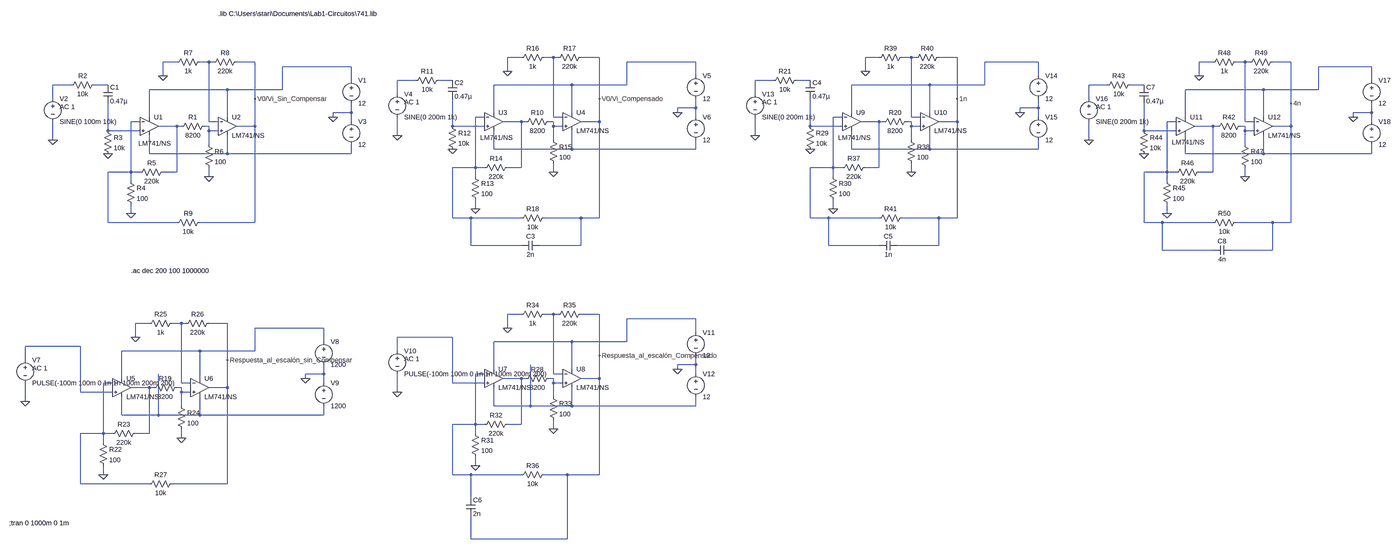
[diagram p0: schematic Draft1.asc, whole sheet]
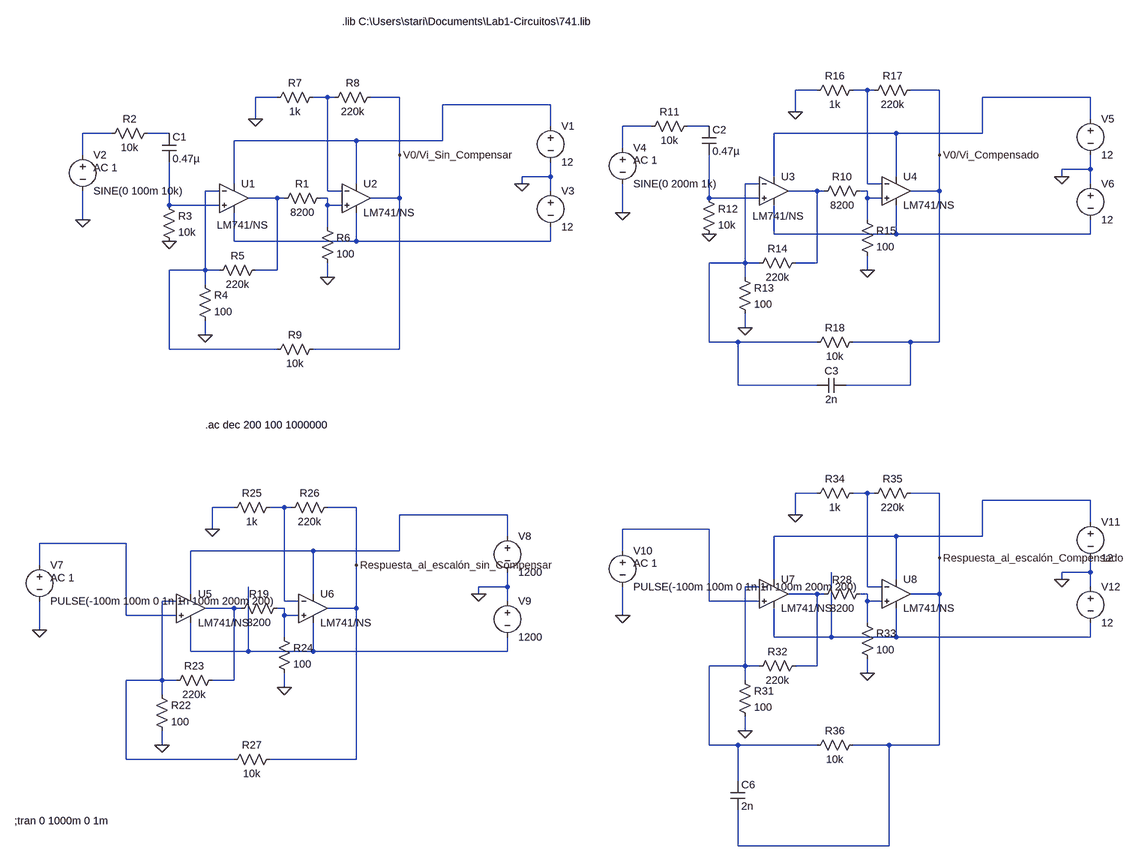
[diagram p1: schematic Draft1.asc, part, row 1 of 1, column 1 of 2]
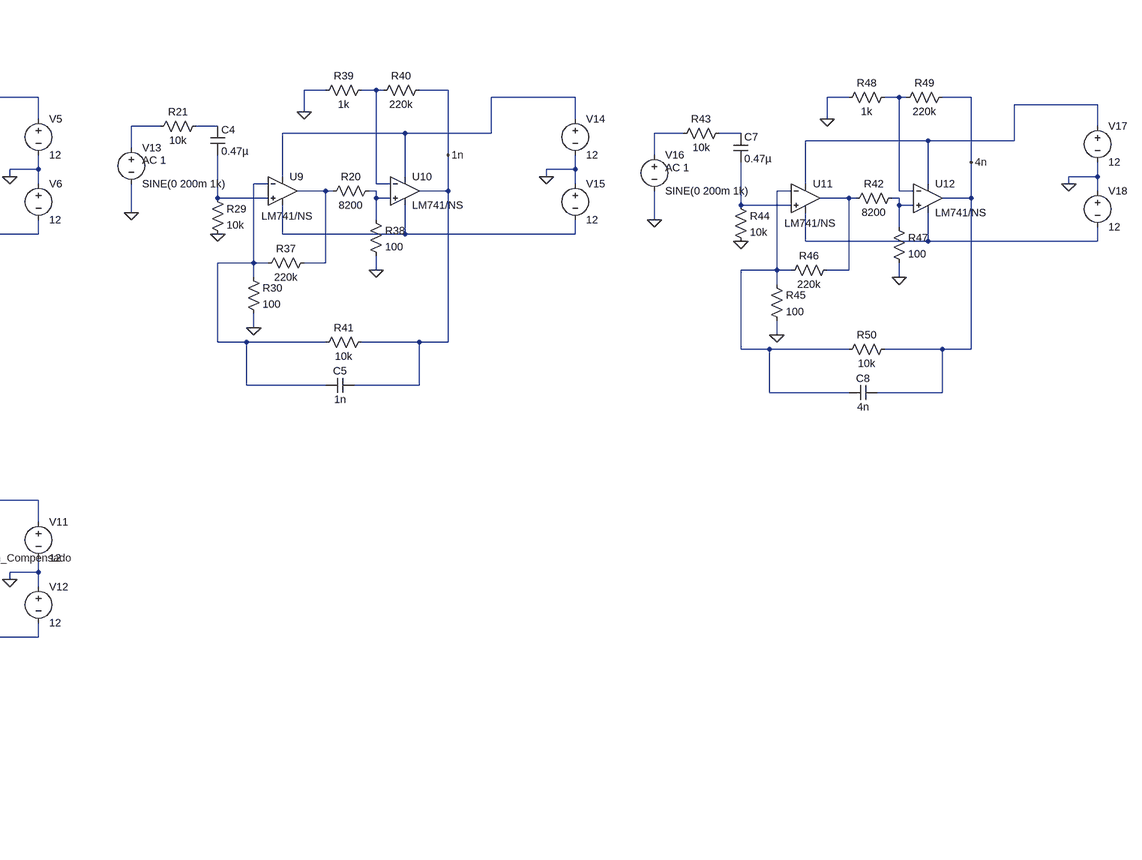
[diagram p2: schematic Draft1.asc, part, row 1 of 1, column 2 of 2]
Draft1.asc, the LTspice schematic file:
Version 4.1
SHEET 1 3112 680
WIRE -1312 -1520 -1360 -1520
WIRE -1200 -1520 -1232 -1520
WIRE -1184 -1520 -1200 -1520
WIRE -1040 -1520 -1104 -1520
WIRE -64 -1520 -112 -1520
WIRE 48 -1520 16 -1520
WIRE 64 -1520 48 -1520
WIRE 208 -1520 144 -1520
WIRE -2512 -1504 -2560 -1504
WIRE -2400 -1504 -2432 -1504
WIRE -2384 -1504 -2400 -1504
WIRE -2240 -1504 -2304 -1504
WIRE -704 -1504 -944 -1504
WIRE 544 -1504 304 -1504
WIRE 1152 -1504 1104 -1504
WIRE 1264 -1504 1232 -1504
WIRE 1280 -1504 1264 -1504
WIRE 1424 -1504 1360 -1504
WIRE -1904 -1488 -2144 -1488
WIRE 1760 -1488 1520 -1488
WIRE -1360 -1472 -1360 -1520
WIRE -112 -1472 -112 -1520
WIRE -2560 -1456 -2560 -1504
WIRE -704 -1456 -704 -1504
WIRE 544 -1456 544 -1504
WIRE 1104 -1456 1104 -1504
WIRE -1904 -1440 -1904 -1488
WIRE -1680 -1440 -1744 -1440
WIRE -1552 -1440 -1600 -1440
WIRE -432 -1440 -496 -1440
WIRE -304 -1440 -352 -1440
WIRE 1760 -1440 1760 -1488
WIRE -2880 -1424 -2944 -1424
WIRE -2752 -1424 -2800 -1424
WIRE -1136 -1424 -1408 -1424
WIRE -944 -1424 -944 -1504
WIRE -944 -1424 -1136 -1424
WIRE 112 -1424 -160 -1424
WIRE 304 -1424 304 -1504
WIRE 304 -1424 112 -1424
WIRE 784 -1424 720 -1424
WIRE 912 -1424 864 -1424
WIRE -2336 -1408 -2608 -1408
WIRE -2144 -1408 -2144 -1488
WIRE -2144 -1408 -2336 -1408
WIRE 1328 -1408 1056 -1408
WIRE 1520 -1408 1520 -1488
WIRE 1520 -1408 1328 -1408
WIRE -1744 -1392 -1744 -1440
WIRE -496 -1392 -496 -1440
WIRE -2944 -1376 -2944 -1424
WIRE -2240 -1376 -2240 -1504
WIRE -1040 -1376 -1040 -1520
WIRE 208 -1376 208 -1520
WIRE 720 -1376 720 -1424
WIRE 1424 -1360 1424 -1504
WIRE -704 -1344 -704 -1376
WIRE -704 -1344 -768 -1344
WIRE 544 -1344 544 -1376
WIRE 544 -1344 480 -1344
WIRE -1904 -1328 -1904 -1360
WIRE -1904 -1328 -1968 -1328
WIRE -1408 -1328 -1408 -1424
WIRE -1136 -1328 -1136 -1424
WIRE -768 -1328 -768 -1344
WIRE -160 -1328 -160 -1424
WIRE 112 -1328 112 -1424
WIRE 480 -1328 480 -1344
WIRE 1760 -1328 1760 -1360
WIRE 1760 -1328 1696 -1328
WIRE -2608 -1312 -2608 -1408
WIRE -2336 -1312 -2336 -1408
WIRE -1968 -1312 -1968 -1328
WIRE -1440 -1312 -1472 -1312
WIRE -1200 -1312 -1200 -1520
WIRE -1168 -1312 -1200 -1312
WIRE -704 -1312 -704 -1344
WIRE -192 -1312 -224 -1312
WIRE 48 -1312 48 -1520
WIRE 80 -1312 48 -1312
WIRE 544 -1312 544 -1344
WIRE 1056 -1312 1056 -1408
WIRE 1328 -1312 1328 -1408
WIRE 1696 -1312 1696 -1328
WIRE -2640 -1296 -2672 -1296
WIRE -2400 -1296 -2400 -1504
WIRE -2368 -1296 -2400 -1296
WIRE -1904 -1296 -1904 -1328
WIRE -1312 -1296 -1376 -1296
WIRE -1296 -1296 -1312 -1296
WIRE -1200 -1296 -1216 -1296
WIRE -1040 -1296 -1040 -1376
WIRE -1040 -1296 -1104 -1296
WIRE -64 -1296 -128 -1296
WIRE -48 -1296 -64 -1296
WIRE 48 -1296 32 -1296
WIRE 208 -1296 208 -1376
WIRE 208 -1296 144 -1296
WIRE 1024 -1296 992 -1296
WIRE 1264 -1296 1264 -1504
WIRE 1296 -1296 1264 -1296
WIRE 1760 -1296 1760 -1328
WIRE -2512 -1280 -2576 -1280
WIRE -2496 -1280 -2512 -1280
WIRE -2400 -1280 -2416 -1280
WIRE -2240 -1280 -2240 -1376
WIRE -2240 -1280 -2304 -1280
WIRE -1552 -1280 -1552 -1376
WIRE -1440 -1280 -1552 -1280
WIRE -1200 -1280 -1200 -1296
WIRE -1168 -1280 -1200 -1280
WIRE -304 -1280 -304 -1376
WIRE -192 -1280 -304 -1280
WIRE 48 -1280 48 -1296
WIRE 80 -1280 48 -1280
WIRE 1152 -1280 1088 -1280
WIRE 1168 -1280 1152 -1280
WIRE 1264 -1280 1248 -1280
WIRE 1424 -1280 1424 -1360
WIRE 1424 -1280 1360 -1280
WIRE -2752 -1264 -2752 -1360
WIRE -2640 -1264 -2752 -1264
WIRE -2400 -1264 -2400 -1280
WIRE -2368 -1264 -2400 -1264
WIRE 912 -1264 912 -1360
WIRE 1024 -1264 912 -1264
WIRE 1264 -1264 1264 -1280
WIRE 1296 -1264 1264 -1264
WIRE -1744 -1248 -1744 -1312
WIRE -496 -1248 -496 -1312
WIRE -2944 -1232 -2944 -1296
WIRE -1200 -1232 -1200 -1280
WIRE 48 -1232 48 -1280
WIRE 720 -1232 720 -1296
WIRE -2400 -1216 -2400 -1264
WIRE 1264 -1216 1264 -1264
WIRE -1408 -1200 -1408 -1264
WIRE -1136 -1200 -1136 -1264
WIRE -1136 -1200 -1408 -1200
WIRE -704 -1200 -704 -1232
WIRE -704 -1200 -1136 -1200
WIRE -160 -1200 -160 -1264
WIRE 112 -1200 112 -1264
WIRE 112 -1200 -160 -1200
WIRE 544 -1200 544 -1232
WIRE 544 -1200 112 -1200
WIRE -2608 -1184 -2608 -1248
WIRE -2336 -1184 -2336 -1248
WIRE -2336 -1184 -2608 -1184
WIRE -1904 -1184 -1904 -1216
WIRE -1904 -1184 -2336 -1184
WIRE 1056 -1184 1056 -1248
WIRE 1328 -1184 1328 -1248
WIRE 1328 -1184 1056 -1184
WIRE 1760 -1184 1760 -1216
WIRE 1760 -1184 1328 -1184
WIRE -1472 -1136 -1472 -1312
WIRE -1472 -1136 -1552 -1136
WIRE -1440 -1136 -1472 -1136
WIRE -1312 -1136 -1312 -1296
WIRE -1312 -1136 -1360 -1136
WIRE -224 -1136 -224 -1312
WIRE -224 -1136 -304 -1136
WIRE -192 -1136 -224 -1136
WIRE -64 -1136 -64 -1296
WIRE -64 -1136 -112 -1136
WIRE -2672 -1120 -2672 -1296
WIRE -2672 -1120 -2752 -1120
WIRE -2640 -1120 -2672 -1120
WIRE -2512 -1120 -2512 -1280
WIRE -2512 -1120 -2560 -1120
WIRE -1200 -1120 -1200 -1152
WIRE 48 -1120 48 -1152
WIRE 992 -1120 992 -1296
WIRE 992 -1120 912 -1120
WIRE 1024 -1120 992 -1120
WIRE 1152 -1120 1152 -1280
WIRE 1152 -1120 1104 -1120
WIRE -2400 -1104 -2400 -1136
WIRE -1472 -1104 -1472 -1136
WIRE -224 -1104 -224 -1136
WIRE 1264 -1104 1264 -1136
WIRE -2672 -1088 -2672 -1120
WIRE 992 -1088 992 -1120
WIRE -1472 -992 -1472 -1024
WIRE -224 -992 -224 -1024
WIRE -2672 -976 -2672 -1008
WIRE 992 -976 992 -1008
WIRE -1552 -960 -1552 -1136
WIRE -1488 -960 -1552 -960
WIRE -1312 -960 -1488 -960
WIRE -1104 -960 -1232 -960
WIRE -1040 -960 -1040 -1296
WIRE -1040 -960 -1104 -960
WIRE -304 -960 -304 -1136
WIRE -240 -960 -304 -960
WIRE -64 -960 -240 -960
WIRE 144 -960 16 -960
WIRE 208 -960 208 -1296
WIRE 208 -960 144 -960
WIRE -2752 -944 -2752 -1120
WIRE -2512 -944 -2752 -944
WIRE -2240 -944 -2240 -1280
WIRE -2240 -944 -2432 -944
WIRE 912 -944 912 -1120
WIRE 976 -944 912 -944
WIRE 1152 -944 976 -944
WIRE 1360 -944 1232 -944
WIRE 1424 -944 1424 -1280
WIRE 1424 -944 1360 -944
WIRE -1488 -864 -1488 -960
WIRE -1312 -864 -1488 -864
WIRE -1104 -864 -1104 -960
WIRE -1104 -864 -1248 -864
WIRE -240 -864 -240 -960
WIRE -64 -864 -240 -864
WIRE 144 -864 144 -960
WIRE 144 -864 0 -864
WIRE 976 -848 976 -944
WIRE 1152 -848 976 -848
WIRE 1360 -848 1360 -944
WIRE 1360 -848 1216 -848
WIRE -1312 -576 -1360 -576
WIRE -1200 -576 -1232 -576
WIRE -1184 -576 -1200 -576
WIRE -1040 -576 -1104 -576
WIRE -704 -560 -944 -560
WIRE -2608 -544 -2656 -544
WIRE -2496 -544 -2528 -544
WIRE -2480 -544 -2496 -544
WIRE -2336 -544 -2400 -544
WIRE -2000 -528 -2240 -528
WIRE -1360 -528 -1360 -576
WIRE -704 -512 -704 -560
WIRE -2656 -496 -2656 -544
WIRE -1552 -496 -1744 -496
WIRE -2000 -480 -2000 -528
WIRE -1136 -480 -1408 -480
WIRE -944 -480 -944 -560
WIRE -944 -480 -1136 -480
WIRE -2848 -464 -3040 -464
WIRE -2432 -448 -2704 -448
WIRE -2240 -448 -2240 -528
WIRE -2240 -448 -2432 -448
WIRE -1744 -448 -1744 -496
WIRE -1040 -432 -1040 -576
WIRE -3040 -416 -3040 -464
WIRE -2336 -416 -2336 -544
WIRE -704 -400 -704 -432
WIRE -704 -400 -768 -400
WIRE -1408 -384 -1408 -480
WIRE -1136 -384 -1136 -480
WIRE -768 -384 -768 -400
WIRE -2000 -368 -2000 -400
WIRE -2000 -368 -2064 -368
WIRE -1440 -368 -1472 -368
WIRE -1200 -368 -1200 -576
WIRE -1168 -368 -1200 -368
WIRE -704 -368 -704 -400
WIRE -2704 -352 -2704 -448
WIRE -2432 -352 -2432 -448
WIRE -2064 -352 -2064 -368
WIRE -1312 -352 -1376 -352
WIRE -1296 -352 -1312 -352
WIRE -1200 -352 -1216 -352
WIRE -1040 -352 -1040 -432
WIRE -1040 -352 -1104 -352
WIRE -2736 -336 -2768 -336
WIRE -2496 -336 -2496 -544
WIRE -2464 -336 -2496 -336
WIRE -2000 -336 -2000 -368
WIRE -1552 -336 -1552 -496
WIRE -1440 -336 -1552 -336
WIRE -1200 -336 -1200 -352
WIRE -1168 -336 -1200 -336
WIRE -2608 -320 -2672 -320
WIRE -2592 -320 -2608 -320
WIRE -2496 -320 -2512 -320
WIRE -2336 -320 -2336 -416
WIRE -2336 -320 -2400 -320
WIRE -2848 -304 -2848 -464
WIRE -2736 -304 -2848 -304
WIRE -2496 -304 -2496 -320
WIRE -2464 -304 -2496 -304
WIRE -1744 -304 -1744 -368
WIRE -1200 -288 -1200 -336
WIRE -3040 -272 -3040 -336
WIRE -2496 -256 -2496 -304
WIRE -1408 -256 -1408 -320
WIRE -1280 -256 -1280 -400
WIRE -1280 -256 -1408 -256
WIRE -1136 -256 -1136 -320
WIRE -1136 -256 -1280 -256
WIRE -704 -256 -704 -288
WIRE -704 -256 -1136 -256
WIRE -2704 -224 -2704 -288
WIRE -2576 -224 -2576 -368
WIRE -2576 -224 -2704 -224
WIRE -2432 -224 -2432 -288
WIRE -2432 -224 -2576 -224
WIRE -2000 -224 -2000 -256
WIRE -2000 -224 -2432 -224
WIRE -1472 -192 -1472 -368
WIRE -1472 -192 -1552 -192
WIRE -1440 -192 -1472 -192
WIRE -1312 -192 -1312 -352
WIRE -1312 -192 -1360 -192
WIRE -1200 -176 -1200 -208
WIRE -2768 -160 -2768 -336
WIRE -2768 -160 -2848 -160
WIRE -2736 -160 -2768 -160
WIRE -2608 -160 -2608 -320
WIRE -2608 -160 -2656 -160
WIRE -1472 -160 -1472 -192
WIRE -2496 -144 -2496 -176
WIRE -2768 -128 -2768 -160
WIRE -1472 -48 -1472 -80
WIRE -2768 -16 -2768 -48
WIRE -1552 -16 -1552 -192
WIRE -1488 -16 -1552 -16
WIRE -1312 -16 -1488 -16
WIRE -1152 -16 -1232 -16
WIRE -1040 -16 -1040 -352
WIRE -1040 -16 -1152 -16
WIRE -2848 16 -2848 -160
WIRE -2608 16 -2848 16
WIRE -2336 16 -2336 -320
WIRE -2336 16 -2528 16
WIRE -1488 64 -1488 -16
WIRE -1488 208 -1488 128
WIRE -1152 208 -1152 -16
WIRE -1152 208 -1488 208
FLAG -2752 -1184 0
FLAG -2672 -976 0
FLAG -2400 -1104 0
FLAG -2560 -1456 0
FLAG -2944 -1232 0
FLAG -1968 -1312 0
FLAG -1552 -1200 0
FLAG -1472 -992 0
FLAG -1200 -1120 0
FLAG -1360 -1472 0
FLAG -1744 -1248 0
FLAG -768 -1328 0
FLAG -2240 -1376 V0/Vi_Sin_Compensar
FLAG -1040 -1376 V0/Vi_Compensado
FLAG -2768 -16 0
FLAG -2496 -144 0
FLAG -2656 -496 0
FLAG -3040 -272 0
FLAG -2064 -352 0
FLAG -1472 -48 0
FLAG -1200 -176 0
FLAG -1360 -528 0
FLAG -1744 -304 0
FLAG -768 -384 0
FLAG -2336 -416 Respuesta_al_escalón_sin_Compensar
FLAG -1040 -432 Respuesta_al_escalón_Compensado
FLAG -304 -1200 0
FLAG -224 -992 0
FLAG 48 -1120 0
FLAG -112 -1472 0
FLAG -496 -1248 0
FLAG 480 -1328 0
FLAG 208 -1376 1n
FLAG 912 -1184 0
FLAG 992 -976 0
FLAG 1264 -1104 0
FLAG 1104 -1456 0
FLAG 720 -1232 0
FLAG 1696 -1312 0
FLAG 1424 -1360 4n
SYMBOL OpAmps\\opamp2 -2608 -1344 R0
WINDOW 3 -38 124 Left 2
SYMATTR InstName U1
SYMATTR Value LM741/NS
SYMBOL OpAmps\\opamp2 -2336 -1344 R0
SYMATTR InstName U2
SYMATTR Value LM741/NS
SYMBOL res -2400 -1296 R90
WINDOW 0 0 56 VBottom 2
WINDOW 3 32 56 VTop 2
SYMATTR InstName R1
SYMATTR Value 8200
SYMBOL res -2896 -1408 R270
WINDOW 0 32 56 VTop 2
WINDOW 3 0 56 VBottom 2
SYMATTR InstName R2
SYMATTR Value 10k
SYMBOL res -2768 -1280 R0
SYMATTR InstName R3
SYMATTR Value 10k
SYMBOL cap -2768 -1424 R0
SYMATTR InstName C1
SYMATTR Value 0.47µ
SYMBOL res -2688 -1104 R0
SYMATTR InstName R4
SYMATTR Value 100
SYMBOL res -2544 -1136 R90
WINDOW 0 0 56 VBottom 2
WINDOW 3 32 56 VTop 2
SYMATTR InstName R5
SYMATTR Value 220k
SYMBOL res -2416 -1232 R0
SYMATTR InstName R6
SYMATTR Value 100
SYMBOL res -2416 -1520 R90
WINDOW 0 0 56 VBottom 2
WINDOW 3 32 56 VTop 2
SYMATTR InstName R7
SYMATTR Value 1k
SYMBOL res -2288 -1520 R90
WINDOW 0 0 56 VBottom 2
WINDOW 3 32 56 VTop 2
SYMATTR InstName R8
SYMATTR Value 220k
SYMBOL res -2416 -960 R90
WINDOW 0 0 56 VBottom 2
WINDOW 3 32 56 VTop 2
SYMATTR InstName R9
SYMATTR Value 10k
SYMBOL voltage -2944 -1392 R0
WINDOW 123 24 44 Left 2
WINDOW 39 0 0 Left 2
SYMATTR Value2 AC 1
SYMATTR InstName V2
SYMATTR Value SINE(0 100m 10k)
SYMBOL voltage -1904 -1456 R0
WINDOW 123 0 0 Left 2
WINDOW 39 0 0 Left 2
SYMATTR InstName V1
SYMATTR Value 12
SYMBOL voltage -1904 -1312 R0
WINDOW 123 0 0 Left 2
WINDOW 39 0 0 Left 2
SYMATTR InstName V3
SYMATTR Value 12
SYMBOL OpAmps\\opamp2 -1408 -1360 R0
WINDOW 3 -47 120 Left 2
SYMATTR InstName U3
SYMATTR Value LM741/NS
SYMBOL OpAmps\\opamp2 -1136 -1360 R0
SYMATTR InstName U4
SYMATTR Value LM741/NS
SYMBOL res -1200 -1312 R90
WINDOW 0 0 56 VBottom 2
WINDOW 3 32 56 VTop 2
SYMATTR InstName R10
SYMATTR Value 8200
SYMBOL res -1696 -1424 R270
WINDOW 0 32 56 VTop 2
WINDOW 3 0 56 VBottom 2
SYMATTR InstName R11
SYMATTR Value 10k
SYMBOL res -1568 -1296 R0
SYMATTR InstName R12
SYMATTR Value 10k
SYMBOL cap -1568 -1440 R0
SYMATTR InstName C2
SYMATTR Value 0.47µ
SYMBOL res -1488 -1120 R0
SYMATTR InstName R13
SYMATTR Value 100
SYMBOL res -1344 -1152 R90
WINDOW 0 0 56 VBottom 2
WINDOW 3 32 56 VTop 2
SYMATTR InstName R14
SYMATTR Value 220k
SYMBOL res -1216 -1248 R0
SYMATTR InstName R15
SYMATTR Value 100
SYMBOL res -1216 -1536 R90
WINDOW 0 0 56 VBottom 2
WINDOW 3 32 56 VTop 2
SYMATTR InstName R16
SYMATTR Value 1k
SYMBOL res -1088 -1536 R90
WINDOW 0 0 56 VBottom 2
WINDOW 3 32 56 VTop 2
SYMATTR InstName R17
SYMATTR Value 220k
SYMBOL res -1216 -976 R90
WINDOW 0 0 56 VBottom 2
WINDOW 3 32 56 VTop 2
SYMATTR InstName R18
SYMATTR Value 10k
SYMBOL voltage -1744 -1408 R0
WINDOW 123 24 44 Left 2
WINDOW 39 0 0 Left 2
SYMATTR Value2 AC 1
SYMATTR InstName V4
SYMATTR Value SINE(0 200m 1k)
SYMBOL voltage -704 -1472 R0
WINDOW 123 0 0 Left 2
WINDOW 39 0 0 Left 2
SYMATTR InstName V5
SYMATTR Value 12
SYMBOL voltage -704 -1328 R0
WINDOW 123 0 0 Left 2
WINDOW 39 0 0 Left 2
SYMATTR InstName V6
SYMATTR Value 12
SYMBOL cap -1248 -880 R90
WINDOW 0 0 32 VBottom 2
WINDOW 3 32 32 VTop 2
SYMATTR InstName C3
SYMATTR Value 2n
SYMBOL OpAmps\\opamp2 -2704 -384 R0
SYMATTR InstName U5
SYMATTR Value LM741/NS
SYMBOL OpAmps\\opamp2 -2432 -384 R0
SYMATTR InstName U6
SYMATTR Value LM741/NS
SYMBOL res -2496 -336 R90
WINDOW 0 0 56 VBottom 2
WINDOW 3 32 56 VTop 2
SYMATTR InstName R19
SYMATTR Value 8200
SYMBOL res -2784 -144 R0
SYMATTR InstName R22
SYMATTR Value 100
SYMBOL res -2640 -176 R90
WINDOW 0 0 56 VBottom 2
WINDOW 3 32 56 VTop 2
SYMATTR InstName R23
SYMATTR Value 220k
SYMBOL res -2512 -272 R0
SYMATTR InstName R24
SYMATTR Value 100
SYMBOL res -2512 -560 R90
WINDOW 0 0 56 VBottom 2
WINDOW 3 32 56 VTop 2
SYMATTR InstName R25
SYMATTR Value 1k
SYMBOL res -2384 -560 R90
WINDOW 0 0 56 VBottom 2
WINDOW 3 32 56 VTop 2
SYMATTR InstName R26
SYMATTR Value 220k
SYMBOL res -2512 0 R90
WINDOW 0 0 56 VBottom 2
WINDOW 3 32 56 VTop 2
SYMATTR InstName R27
SYMATTR Value 10k
SYMBOL voltage -3040 -432 R0
WINDOW 123 24 44 Left 2
WINDOW 39 0 0 Left 2
SYMATTR Value2 AC 1
SYMATTR InstName V7
SYMATTR Value PULSE(-100m 100m 0 1n 1n 100m 200m 200)
SYMBOL voltage -2000 -496 R0
WINDOW 123 0 0 Left 2
WINDOW 39 0 0 Left 2
SYMATTR InstName V8
SYMATTR Value 1200
SYMBOL voltage -2000 -352 R0
WINDOW 123 0 0 Left 2
WINDOW 39 0 0 Left 2
SYMATTR InstName V9
SYMATTR Value 1200
SYMBOL OpAmps\\opamp2 -1408 -416 R0
SYMATTR InstName U7
SYMATTR Value LM741/NS
SYMBOL OpAmps\\opamp2 -1136 -416 R0
SYMATTR InstName U8
SYMATTR Value LM741/NS
SYMBOL res -1200 -368 R90
WINDOW 0 0 56 VBottom 2
WINDOW 3 32 56 VTop 2
SYMATTR InstName R28
SYMATTR Value 8200
SYMBOL res -1488 -176 R0
SYMATTR InstName R31
SYMATTR Value 100
SYMBOL res -1344 -208 R90
WINDOW 0 0 56 VBottom 2
WINDOW 3 32 56 VTop 2
SYMATTR InstName R32
SYMATTR Value 220k
SYMBOL res -1216 -304 R0
SYMATTR InstName R33
SYMATTR Value 100
SYMBOL res -1216 -592 R90
WINDOW 0 0 56 VBottom 2
WINDOW 3 32 56 VTop 2
SYMATTR InstName R34
SYMATTR Value 1k
SYMBOL res -1088 -592 R90
WINDOW 0 0 56 VBottom 2
WINDOW 3 32 56 VTop 2
SYMATTR InstName R35
SYMATTR Value 220k
SYMBOL res -1216 -32 R90
WINDOW 0 0 56 VBottom 2
WINDOW 3 32 56 VTop 2
SYMATTR InstName R36
SYMATTR Value 10k
SYMBOL voltage -1744 -464 R0
WINDOW 123 24 44 Left 2
WINDOW 39 0 0 Left 2
SYMATTR Value2 AC 1
SYMATTR InstName V10
SYMATTR Value PULSE(-100m 100m 0 1n 1n 100m 200m 200)
SYMBOL voltage -704 -528 R0
WINDOW 123 0 0 Left 2
WINDOW 39 0 0 Left 2
SYMATTR InstName V11
SYMATTR Value 12
SYMBOL voltage -704 -384 R0
WINDOW 123 0 0 Left 2
WINDOW 39 0 0 Left 2
SYMATTR InstName V12
SYMATTR Value 12
SYMBOL cap -1504 64 R0
SYMATTR InstName C6
SYMATTR Value 2n
SYMBOL OpAmps\\opamp2 -160 -1360 R0
WINDOW 3 -47 120 Left 2
SYMATTR InstName U9
SYMATTR Value LM741/NS
SYMBOL OpAmps\\opamp2 112 -1360 R0
SYMATTR InstName U10
SYMATTR Value LM741/NS
SYMBOL res 48 -1312 R90
WINDOW 0 0 56 VBottom 2
WINDOW 3 32 56 VTop 2
SYMATTR InstName R20
SYMATTR Value 8200
SYMBOL res -448 -1424 R270
WINDOW 0 32 56 VTop 2
WINDOW 3 0 56 VBottom 2
SYMATTR InstName R21
SYMATTR Value 10k
SYMBOL res -320 -1296 R0
SYMATTR InstName R29
SYMATTR Value 10k
SYMBOL cap -320 -1440 R0
SYMATTR InstName C4
SYMATTR Value 0.47µ
SYMBOL res -240 -1120 R0
SYMATTR InstName R30
SYMATTR Value 100
SYMBOL res -96 -1152 R90
WINDOW 0 0 56 VBottom 2
WINDOW 3 32 56 VTop 2
SYMATTR InstName R37
SYMATTR Value 220k
SYMBOL res 32 -1248 R0
SYMATTR InstName R38
SYMATTR Value 100
SYMBOL res 32 -1536 R90
WINDOW 0 0 56 VBottom 2
WINDOW 3 32 56 VTop 2
SYMATTR InstName R39
SYMATTR Value 1k
SYMBOL res 160 -1536 R90
WINDOW 0 0 56 VBottom 2
WINDOW 3 32 56 VTop 2
SYMATTR InstName R40
SYMATTR Value 220k
SYMBOL res 32 -976 R90
WINDOW 0 0 56 VBottom 2
WINDOW 3 32 56 VTop 2
SYMATTR InstName R41
SYMATTR Value 10k
SYMBOL voltage -496 -1408 R0
WINDOW 123 24 44 Left 2
WINDOW 39 0 0 Left 2
SYMATTR Value2 AC 1
SYMATTR InstName V13
SYMATTR Value SINE(0 200m 1k)
SYMBOL voltage 544 -1472 R0
WINDOW 123 0 0 Left 2
WINDOW 39 0 0 Left 2
SYMATTR InstName V14
SYMATTR Value 12
SYMBOL voltage 544 -1328 R0
WINDOW 123 0 0 Left 2
WINDOW 39 0 0 Left 2
SYMATTR InstName V15
SYMATTR Value 12
SYMBOL cap 0 -880 R90
WINDOW 0 0 32 VBottom 2
WINDOW 3 32 32 VTop 2
SYMATTR InstName C5
SYMATTR Value 1n
SYMBOL OpAmps\\opamp2 1056 -1344 R0
WINDOW 3 -47 120 Left 2
SYMATTR InstName U11
SYMATTR Value LM741/NS
SYMBOL OpAmps\\opamp2 1328 -1344 R0
SYMATTR InstName U12
SYMATTR Value LM741/NS
SYMBOL res 1264 -1296 R90
WINDOW 0 0 56 VBottom 2
WINDOW 3 32 56 VTop 2
SYMATTR InstName R42
SYMATTR Value 8200
SYMBOL res 768 -1408 R270
WINDOW 0 32 56 VTop 2
WINDOW 3 0 56 VBottom 2
SYMATTR InstName R43
SYMATTR Value 10k
SYMBOL res 896 -1280 R0
SYMATTR InstName R44
SYMATTR Value 10k
SYMBOL cap 896 -1424 R0
SYMATTR InstName C7
SYMATTR Value 0.47µ
SYMBOL res 976 -1104 R0
SYMATTR InstName R45
SYMATTR Value 100
SYMBOL res 1120 -1136 R90
WINDOW 0 0 56 VBottom 2
WINDOW 3 32 56 VTop 2
SYMATTR InstName R46
SYMATTR Value 220k
SYMBOL res 1248 -1232 R0
SYMATTR InstName R47
SYMATTR Value 100
SYMBOL res 1248 -1520 R90
WINDOW 0 0 56 VBottom 2
WINDOW 3 32 56 VTop 2
SYMATTR InstName R48
SYMATTR Value 1k
SYMBOL res 1376 -1520 R90
WINDOW 0 0 56 VBottom 2
WINDOW 3 32 56 VTop 2
SYMATTR InstName R49
SYMATTR Value 220k
SYMBOL res 1248 -960 R90
WINDOW 0 0 56 VBottom 2
WINDOW 3 32 56 VTop 2
SYMATTR InstName R50
SYMATTR Value 10k
SYMBOL voltage 720 -1392 R0
WINDOW 123 24 44 Left 2
WINDOW 39 0 0 Left 2
SYMATTR Value2 AC 1
SYMATTR InstName V16
SYMATTR Value SINE(0 200m 1k)
SYMBOL voltage 1760 -1456 R0
WINDOW 123 0 0 Left 2
WINDOW 39 0 0 Left 2
SYMATTR InstName V17
SYMATTR Value 12
SYMBOL voltage 1760 -1312 R0
WINDOW 123 0 0 Left 2
WINDOW 39 0 0 Left 2
SYMATTR InstName V18
SYMATTR Value 12
SYMBOL cap 1216 -864 R90
WINDOW 0 0 32 VBottom 2
WINDOW 3 32 32 VTop 2
SYMATTR InstName C8
SYMATTR Value 4n
TEXT -2368 -1768 Left 2 !.lib C:\\Users\\stari\\Documents\\Lab1-Circuitos\\741.lib
TEXT -2672 -776 Left 2 !.ac dec 200 100 1000000
TEXT -3096 152 Left 2 !;tran 0 1000m 0 1m

The netlist it stands for:
* Draft1.asc
X§U1 N031 N019 N007 N035 N025 LM741/NS  ; pins In+ In- V+ V- OUT
X§U2 N026 N003 N007 N035 V0/Vi_Sin_Compensar LM741/NS  ; pins In+ In- V+ V- OUT
R1 N026 N025 8200
R2 N013 N014 10k
R3 N031 0 10k
C1 N014 N031 0.47µ
R4 N019 0 100
R5 N025 N019 220k
R6 N026 0 100
R7 N003 0 1k
R8 V0/Vi_Sin_Compensar N003 220k
R9 V0/Vi_Sin_Compensar N019 10k
V2 N013 0 SINE(0 100m 10k) AC 1
V1 N007 0 12
V3 0 N035 12
X§U3 N027 N017 N004 N033 N020 LM741/NS  ; pins In+ In- V+ V- OUT
X§U4 N021 N001 N004 N033 V0/Vi_Compensado LM741/NS  ; pins In+ In- V+ V- OUT
R10 N021 N020 8200
R11 N009 N010 10k
R12 N027 0 10k
C2 N010 N027 0.47µ
R13 N017 0 100
R14 N020 N017 220k
R15 N021 0 100
R16 N001 0 1k
R17 V0/Vi_Compensado N001 220k
R18 V0/Vi_Compensado N017 10k
V4 N009 0 SINE(0 200m 1k) AC 1
V5 N004 0 12
V6 0 N033 12
C3 V0/Vi_Compensado N017 2n
X§U5 N042 N046 N040 N050 N047 LM741/NS  ; pins In+ In- V+ V- OUT
X§U6 N048 N039 N040 N050 Respuesta_al_escalón_sin_Compensar LM741/NS  ; pins In+ In- V+ V- OUT
R19 N048 N047 8200
R22 N046 0 100
R23 N047 N046 220k
R24 N048 0 100
R25 N039 0 1k
R26 Respuesta_al_escalón_sin_Compensar N039 220k
R27 Respuesta_al_escalón_sin_Compensar N046 10k
V7 N042 0 PULSE(-100m 100m 0 1n 1n 100m 200m 200) AC 1
V8 N040 0 1200
V9 0 N050 1200
X§U7 N041 N043 N038 N049 N044 LM741/NS  ; pins In+ In- V+ V- OUT
X§U8 N045 N037 N038 N049 Respuesta_al_escalón_Compensado LM741/NS  ; pins In+ In- V+ V- OUT
R28 N045 N044 8200
R31 N043 0 100
R32 N044 N043 220k
R33 N045 0 100
R34 N037 0 1k
R35 Respuesta_al_escalón_Compensado N037 220k
R36 Respuesta_al_escalón_Compensado N043 10k
V10 N041 0 PULSE(-100m 100m 0 1n 1n 100m 200m 200) AC 1
V11 N038 0 12
V12 0 N049 12
C6 N043 Respuesta_al_escalón_Compensado 2n
X§U9 N028 N018 N005 N034 N022 LM741/NS  ; pins In+ In- V+ V- OUT
X§U10 N023 N002 N005 N034 1n LM741/NS  ; pins In+ In- V+ V- OUT
R20 N023 N022 8200
R21 N011 N012 10k
R29 N028 0 10k
C4 N012 N028 0.47µ
R30 N018 0 100
R37 N022 N018 220k
R38 N023 0 100
R39 N002 0 1k
R40 1n N002 220k
R41 1n N018 10k
V13 N011 0 SINE(0 200m 1k) AC 1
V14 N005 0 12
V15 0 N034 12
C5 1n N018 1n
X§U11 N032 N024 N008 N036 N029 LM741/NS  ; pins In+ In- V+ V- OUT
X§U12 N030 N006 N008 N036 4n LM741/NS  ; pins In+ In- V+ V- OUT
R42 N030 N029 8200
R43 N015 N016 10k
R44 N032 0 10k
C7 N016 N032 0.47µ
R45 N024 0 100
R46 N029 N024 220k
R47 N030 0 100
R48 N006 0 1k
R49 4n N006 220k
R50 4n N024 10k
V16 N015 0 SINE(0 200m 1k) AC 1
V17 N008 0 12
V18 0 N036 12
C8 4n N024 4n
.lib C:\Users\stari\Documents\Lab1-Circuitos\741.lib
.ac dec 200 100 1000000
;tran 0 1000m 0 1m
.backanno
.end